# EAGLE design MatrixPi (EAGLE 7.5.0)
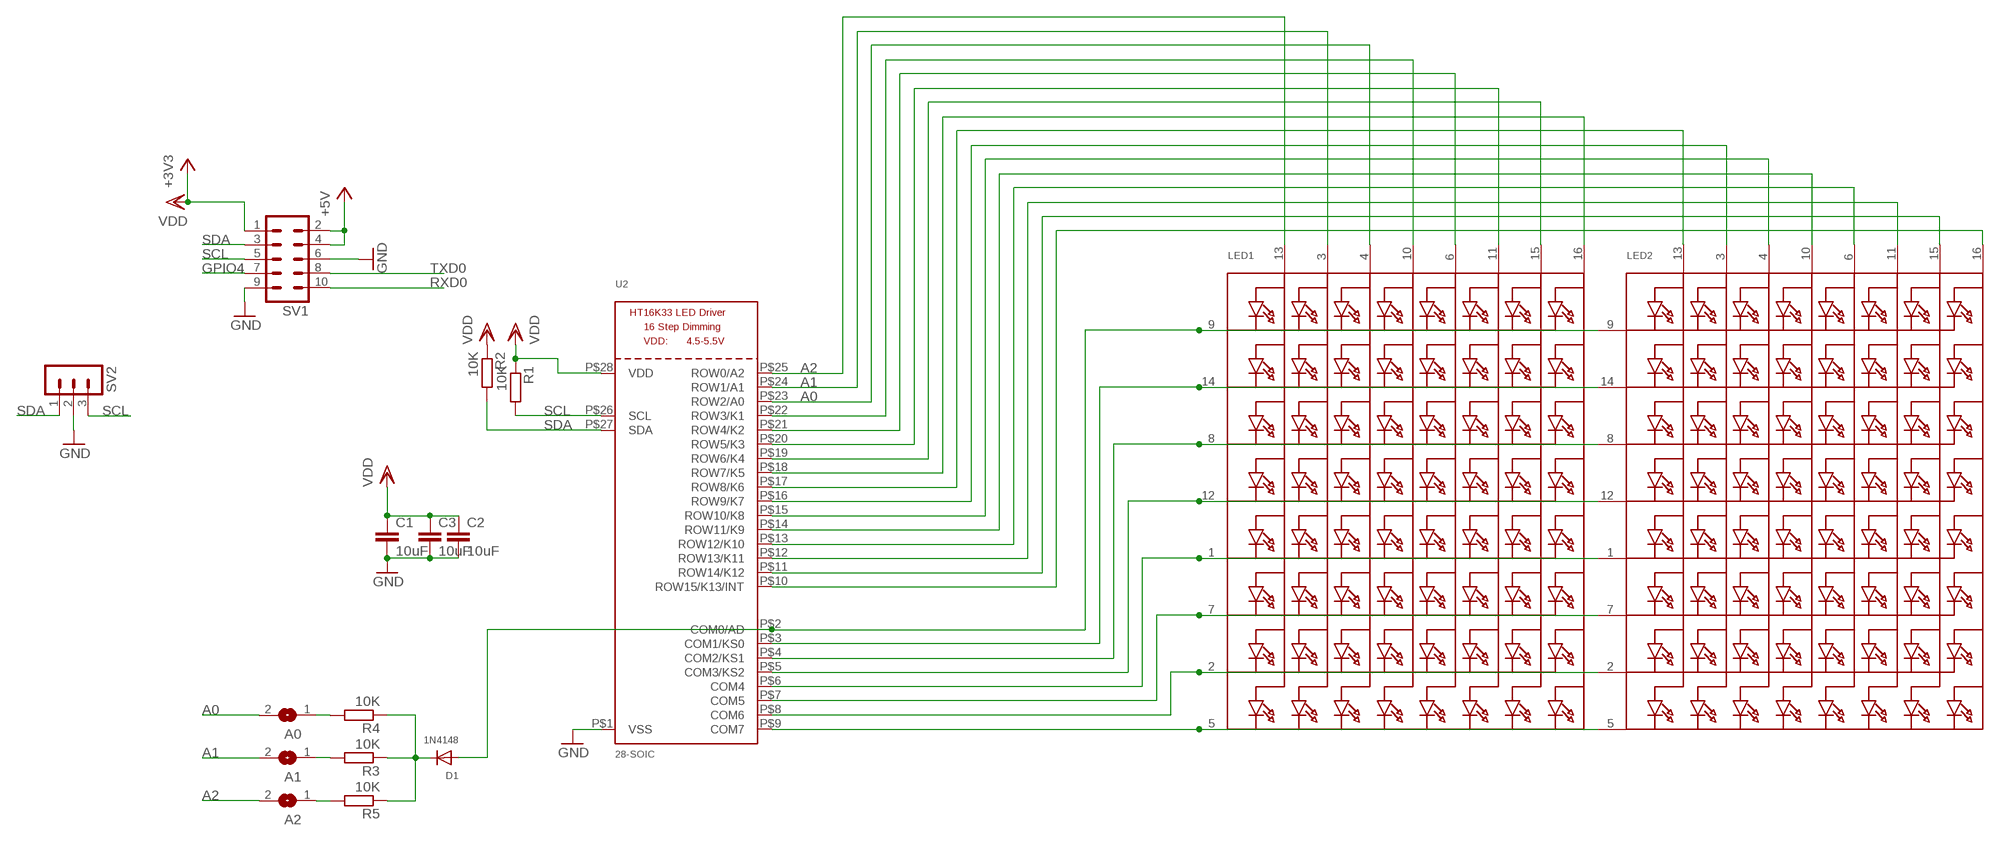
[diagram p0: schematic, sheet 1]

## Parts
A0  SOLDERJUMPERREFLOW_NOPASTE  [SOLDERJUMPER_REFLOW_NOPASTE]
A1  SOLDERJUMPERREFLOW_NOPASTE  [SOLDERJUMPER_REFLOW_NOPASTE]
A2  SOLDERJUMPERREFLOW_NOPASTE  [SOLDERJUMPER_REFLOW_NOPASTE]
C1  10uF  C-EUC0805  [C0805]
C2  10uF  C-EUC0805  [C0805]
C3  10uF  C-EUC0805  [C0805]
D1  1N4148  DIODESOD-323F  [SOD-323F]
LED1  MATRIX_8X8_ROWCATHODE  [TA15-11CGKWA]
LED2  MATRIX_8X8_ROWCATHODE  [TA15-11CGKWA]
R1  10K  R-EU_M0805  [M0805]
R2  10K  R-EU_M0805  [M0805]
R3  10K  R-EU_M0805  [M0805]
R4  10K  R-EU_M0805  [M0805]
R5  10K  R-EU_M0805  [M0805]
SV1  MA05-2  [MA05-2]
SV2  MA03-1  [MA03-1]
U2  28-SOIC  HT16K33_SOP28  [SOP28_300MIL]

## Nets
+5V: SV1.2 SV1.4
A0: A0.2 LED1.4(A3) U2.P$23(ROW2/A0)
A1: A1.2 LED1.3(A2) U2.P$24(ROW1/A1)
A2: A2.2 LED1.13(A1) U2.P$25(ROW0/A2)
GND: C1.2 C2.2 C3.2 SV1.6 SV1.9 SV2.2 U2.P$1(VSS)
GPIO4: SV1.7
N$1: LED1.5(K8) LED2.5(K8) U2.P$9(COM7)
N$2: LED1.2(K7) LED2.2(K7) U2.P$8(COM6)
N$3: LED1.7(K6) LED2.7(K6) U2.P$7(COM5)
N$4: LED1.1(K5) LED2.1(K5) U2.P$6(COM4)
N$5: LED1.12(K4) LED2.12(K4) U2.P$5(COM3/KS2)
N$6: LED1.8(K3) LED2.8(K3) U2.P$4(COM2/KS1)
N$7: LED1.14(K2) LED2.14(K2) U2.P$3(COM1/KS0)
N$8: D1.A LED1.9(K1) LED2.9(K1) U2.P$2(COM0/AD)
N$9: A2.1 R5.2
N$10: LED2.15(A7) U2.P$11(ROW14/K12)
N$11: LED2.11(A6) U2.P$12(ROW13/K11)
N$12: LED2.16(A8) U2.P$10(ROW15/K13/INT)
N$16: D1.C R3.1 R4.1 R5.1
N$19: A1.1 R3.2
N$20: A0.1 R4.2
N$22: LED1.16(A8) U2.P$18(ROW7/K5)
N$23: LED1.15(A7) U2.P$19(ROW6/K4)
N$25: LED1.6(A5) U2.P$21(ROW4/K2)
N$26: LED1.10(A4) U2.P$22(ROW3/K1)
N$35: LED1.11(A6) U2.P$20(ROW5/K3)
N$38: LED2.13(A1) U2.P$17(ROW8/K6)
N$39: LED2.3(A2) U2.P$16(ROW9/K7)
N$40: LED2.10(A4) U2.P$14(ROW11/K9)
N$41: LED2.4(A3) U2.P$15(ROW10/K8)
N$42: LED2.6(A5) U2.P$13(ROW12/K10)
RXD0: SV1.10
SCL: R1.2 SV1.5 SV2.3 U2.P$26(SCL)
SDA: R2.2 SV1.3 SV2.1 U2.P$27(SDA)
TXD0: SV1.8
VDD: C1.1 C2.1 C3.1 R1.1 R2.1 SV1.1 U2.P$28(VDD) ; supply symbol labelled +3V3

## Library data of the parts
A0 A1 A2 = microbuilder:SOLDERJUMPER: SMD Solder JUMPER Solder the two pads together to create a connection, or remove the solder to break it. REFLOW - Use this footprint for solder paste and reflow ovens. WAVE - Use this footprint for hand-soldering (larger pads). CLOSED - Has a trace between the two pads to ensure it is closed by default. The trace needs to be cut to disable the jumper, and can be closed again by creating a solder bridge between the two pads.
C1-C3 = rcl:C-EU: CAPACITOR, European symbol
D1 = adafruit:DIODE: Diode SMADIODE - SMA Surface Mount Package 20V 1A Schottky Diode Digikey: 641-1014-6-ND DO-1N4148 - Through Hole Small Current Diode SOD-123 20V 1 A (.5mV Vf) Schottky Diode - Digikey: MBRX120TPMSCT-ND SOD-323 10V 570mA (.38mV Vf, 3ns) Schottky Diode - Digikey: ZLLS410CT-ND SOD-523 30V 30mA Schottky Diode (RB751S-40TE61) - Digikey: RB751S-40TE61CT-ND SOT23-R/W - SOT23 Package (R = Solder Paste/Reflow Ovens, W = Hand-Soldering) BAT54Film 40V 300mA - Digikey: 497-7162-1-ND
LED1 LED2 = matrix_parts:MATRIX_8X8_ROWCATHODE: 8x8 LED Matrix Displays: Row = Cathode 38mm Green 8x8 Matrix, 3.7mm Round LEDs - TA15-11CGKWA
R1-R5 = resistor:R-EU_: RESISTOR, European symbol
SV1 = con-lstb:MA05-2: PIN HEADER; OC_FARNELL: unknown; OC_NEWARK: unknown
SV2 = con-lstb:MA03-1: PIN HEADER; OC_FARNELL: unknown; OC_NEWARK: unknown
U2 = microbuilder:HT16K33_SOP28

## Board
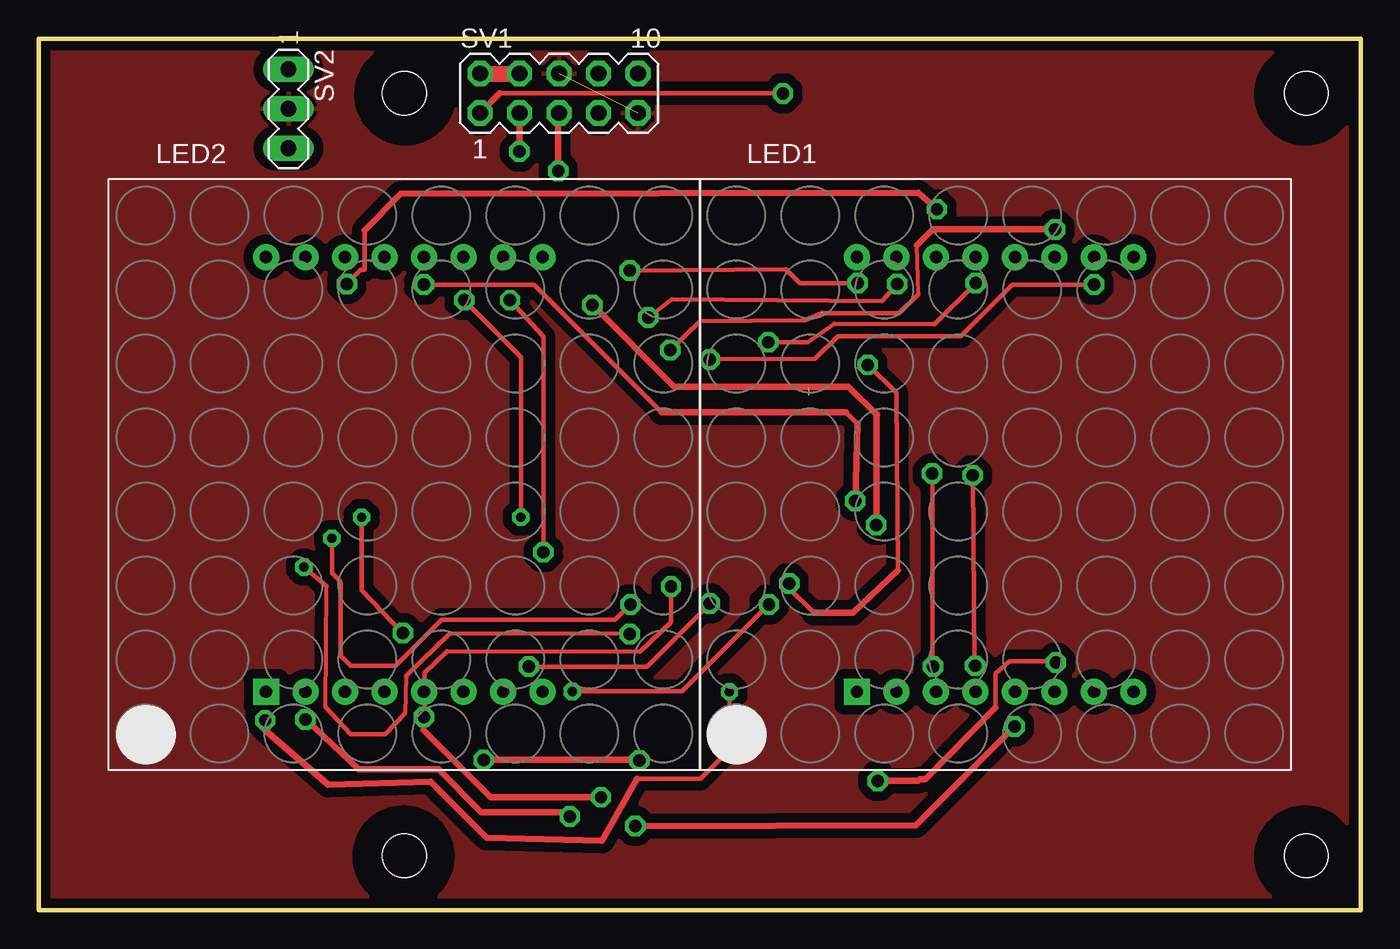
[diagram p1: board, top side]
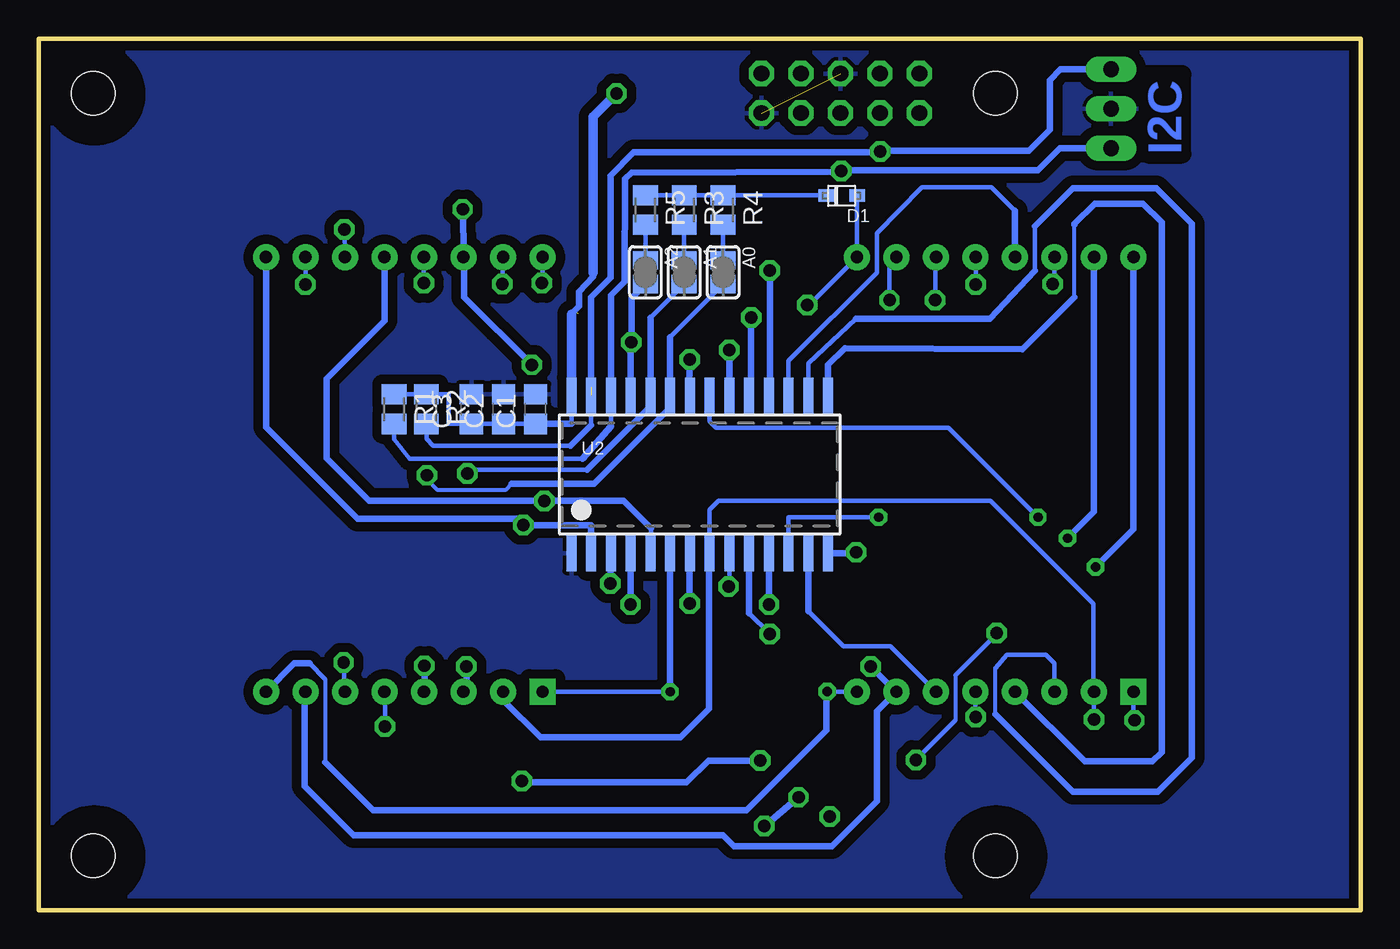
[diagram p2: board, bottom side, seen from below]

Size 85 x 56 mm. Coordinates in mm from the lower left corner, seen from the top.
Outline: 0,0 0,56 85,56 85,0 0,0
Copper layers (1*16): Top 0.035mm / dielectric 1.5mm / Bottom 0.035mm
Design rules "SparkFun": minimum track width 8mil, minimum drill 20mil, track to track 8mil, track to pad 8mil, pad to pad 8mil, via to via 8mil, smd to smd 8mil, copper to edge 10mil, drill to drill 8mil, minimum pad ring 12mil, minimum via ring 10mil, stop-mask expansion 4mil, vias tented up to drill 25mil, thermal gap 10mil
Holes 2.8 mm at 23.5,3.5 81.5,3.5 81.5,52.5 23.5,52.5
tRestrict: area 20.9,0.9 to 26,6; area 78.9,0.9 to 84,6; area 78.9,49.9 to 84,55; area 21,49.9 to 26.1,55
bRestrict: area 20.9,0.9 to 26,6; area 78.9,0.9 to 84,6; area 78.9,49.9 to 84,55; area 21,49.9 to 26.1,55
vRestrict: area 33.2,21.7 to 51.4,34.4; area 52,28.6 to 63.2,34.4; area 39.8,39.1 to 47.1,47.1; area 14.3,47.7 to 20.9,55.7

### Footprints (pad centres in the part's own frame; a part is rotated, then mirrored left to right if it is on the bottom)
SOLDERJUMPER_REFLOW_NOPASTE = smd 1.168 x 1.6: 1 -0.762,0; 2 0.762,0
C0805 = smd 1.3 x 1.5: 1 -0.95,0; 2 0.95,0
SOD-323F = smd 1 x 0.8: A -1,0; C 1,0
TA15-11CGKWA = drill 0.8 pad 1.676 square: 1 -8.89,-13.97 | drill 0.8 pad 1.676: 2 -6.35,-13.97; 3 -3.81,-13.97; 4 -1.27,-13.97; 5 1.27,-13.97; 6 3.81,-13.97; 7 6.35,-13.97; 8 8.89,-13.97; 9 8.89,13.97; 10 6.35,13.97; 11 3.81,13.97; 12 1.27,13.97; 13 -1.27,13.97; 14 -3.81,13.97; 15 -6.35,13.97; 16 -8.89,13.97
M0805 = smd 1.3 x 1.6: 1 -0.95,0; 2 0.95,0
MA05-2 = drill 1.016 octagon: 1 -5.08,-1.27; 2 -5.08,1.27; 3 -2.54,-1.27; 4 -2.54,1.27; 5 0,-1.27; 6 0,1.27; 7 2.54,-1.27; 8 2.54,1.27; 9 5.08,-1.27; 10 5.08,1.27
MA03-1 = drill 1.016 long: 1 -2.54,0; 2 0,0; 3 2.54,0
SOP28_300MIL = smd 0.635 x 2.286: P$1 -8.255,-5.08; P$2 -6.985,-5.08; P$3 -5.715,-5.08; P$4 -4.445,-5.08; P$5 -3.175,-5.08; P$6 -1.905,-5.08; P$7 -0.635,-5.08; P$8 0.635,-5.08; P$9 1.905,-5.08; P$10 3.175,-5.08; P$11 4.445,-5.08; P$12 5.715,-5.08; P$13 6.985,-5.08; P$14 8.255,-5.08; P$15 8.255,5.08; P$16 6.985,5.08; P$17 5.715,5.08; P$18 4.445,5.08; P$19 3.175,5.08; P$20 1.905,5.08; P$21 0.635,5.08; P$22 -0.635,5.08; P$23 -1.905,5.08; P$24 -3.175,5.08; P$25 -4.445,5.08; P$26 -5.715,5.08; P$27 -6.985,5.08; P$28 -8.255,5.08

### Placement (x,y rotation side)
A0  41,41 270 bottom
A1  43.5,41 270 bottom
A2  46,41 270 bottom
C1  53.06,32.2 90 bottom
C2  55.12,32.2 90 bottom
C3  57.19,32.2 90 bottom
D1  33.38,45.92 180 bottom
LED1  61.5,28 0 top
LED2  23.5,28 0 top
R1  62.15,32.2 270 bottom
R2  60.08,32.2 270 bottom
R3  43.5,45 270 bottom
R4  41,45 270 bottom
R5  46,45 270 bottom
SV1  33.45,52.5 0 top
SV2  16.05,51.5 270 top
U2  42.5,28 0 bottom

### Tracks (layer width: path | path; a pad name or v marks a point on that pad's centre or on a via)
+5V
  Top 1.016: SV1.2 SV1.4
A0  (via drill 0.8)
  Top 0.305: v60.05,27.95 60.15,15.75 v60.2,15.7
  Bottom 0.254: 54.6,27.4 55,27 59.35,27 60.05,27.7 v60.05,27.95
  Bottom 0.305: A0.2 44.41,36.83 | U2.P$23 44.41,32.3 | 60.2,14.06 LED1.4
  Bottom 0.406: 44.41,36.83 U2.P$23 | 44.41,32.3 49.3,27.4 54.6,27.4 | v60.2,15.7 60.2,14.06
A1  (via drill 0.8)
  Top 0.305: v57.45,28.05 57.45,15.7 v57.5,15.65
  Bottom 0.305: A1.2 45.67,38.06 | U2.P$24 45.67,32.38 | 49.75,28.3 57.2,28.3 v57.45,28.05 | 57.5,14.22 LED1.3
  Bottom 0.406: 45.67,38.06 U2.P$24 | 45.67,32.38 49.75,28.3 | v57.5,15.65 57.5,14.22
A2  (via drill 0.8)
  Top 0.305: v60.25,40.3 57.6,37.65 51.15,37.7 49.45,36.5 v46.9,36.5
  Bottom 0.305: LED1.13 v60.25,40.3
  Bottom 0.406: A2.2 46.9,39.34 v46.9,36.5 46.95,36.45 U2.P$25
GND  (1 unrouted)
  pour Top (isolate 0.61): 0,55.88 0,0 86.36,0 86.36,55.88
  pour Bottom (isolate 0.61): 0,55.88 0,0 86.36,0 86.36,55.88
N$1  (via drill 0.8)
  Top 0.305: 24.75,11.55 v24.75,12.4 24.8,12.45 24.8,15.25 26.25,16.65 38.65,16.6 40.65,18.5 v40.65,20.8
  Top 0.406: 24.75,11.55 29.05,7.25 v36.15,7.25 | v38.35,5.4 56.4,5.45 v62.75,11.8
  Bottom 0.305: LED2.5 24.77,12.42 v24.75,12.4 | v62.75,11.8 62.75,14.01 LED1.5 | U2.P$9 40.59,20.86 v40.65,20.8
  Bottom 0.406: v36.15,7.25 v38.35,5.4
N$2  (via drill 0.8)
  Top 0.305: 33.9,6 v34.15,6 33.85,6.3
  Top 0.406: v17.15,12.25 20.55,9.05 25.7,9.05 28.45,6.3 33.85,6.3
  Bottom 0.305: v17.15,12.25 LED2.2 17.2,14.08 17.2,19.7 23.8,26.3 41.3,26.3 41.87,25.73 U2.P$8
  Bottom 0.406: LED1.2 55.15,13.5 52.75,11.1 43.75,11.1 41.9,12.95 41.9,22.89 U2.P$8
N$3  (via drill 0.8)
  Top 0.305: v43.15,19.7 39.1,15.65 v31.5,15.65
  Bottom 0.305: 67.9,13.98 LED1.7 | U2.P$7 43.15,22.91 | 29.88,14.03 LED2.7
  Bottom 0.406: 43.15,22.91 v43.15,19.7 | v31.5,15.65 29.88,14.03 | 67.9,13.98 67.9,7.95 64.75,4.8 41,4.8 40.3,4.1 34,4.1 31.1,7 31.1,12.78 LED2.7
N$4  (via drill 0.6, 0.8)
  Top 0.305: 14.55,11.55 v14.55,12.2 | 38.45,8.45 42.55,8.45 44.4,10.3 v44.4,14.03 v44.41,14.03
  Top 0.406: 14.55,11.55 18.6,8.05 25.2,8.25 28.8,4.65 36.2,4.45 38.45,8.45
  Bottom 0.305: v44.41,14.03 LED1.1 | v14.55,12.2 14.61,12.26 LED2.1
  Bottom 0.406: U2.P$6 v44.41,14.03
N$5  (via drill 0.8)
  Top 0.305: v24.75,40.2 31.85,40.2 40.05,32 | 51.9,32 52.65,31.25
  Top 0.406: 40.05,32 51.9,32 | 52.65,31.25 v52.5,26.3
  Bottom 0.305: LED2.12 24.75,41.97 v24.75,40.2 | 45.65,24.55 45.65,22.95 U2.P$5
  Bottom 0.406: LED1.12 62.77,37.88 66.5,34.15 66.5,29.05 63.75,26.3 v52.5,26.3 47.4,26.3 45.65,24.55
N$6  (via drill 0.6, 0.8)
  Top 0.305: v46.95,19.65 41.35,14.05 v34.3,14.05
  Bottom 0.254: 66.6,14.85 66.6,9.5
  Bottom 0.305: 67.6,15.85 66.6,14.85 | 32.35,13.99 LED2.8 34.28,14.03 v34.3,14.05 | v46.95,19.66 v46.95,19.65
  Bottom 0.406: LED1.8 68.57,15.85 67.6,15.85 | U2.P$4 v46.95,19.66 | 66.6,9.5 63.5,6.4 39.5,6.4 34.35,11.55 34.35,14 v34.3,14.05
N$7  (via drill 0.8)
  Top 0.305: v53.3,35.05 55.15,33.25 55.25,21.85 | 49.85,19.1 48.25,20.7 v48.25,21 | 19.75,40.15 v19.8,40.25 20.7,41.15 20.95,41.15 20.95,43.7
  Top 0.406: 55.25,21.85 52.35,19.1 49.85,19.1 | 20.95,43.7 23.25,46.05 56.55,46.1 v57.75,45.05
  Bottom 0.305: U2.P$3 48.25,22.89 | 57.65,41.93 LED1.14 57.65,42.01 | LED2.14 19.69,40.36 v19.8,40.25
  Bottom 0.406: 48.25,22.89 v48.25,21 | 57.65,41.93 57.65,39.4 v53.3,35.05 | v57.75,45.05 57.65,42.01
N$8  (via drill 0.8)
  Top 0.305: 53.9,31.85 53.85,31.9
  Top 0.406: v35.6,38.9 40.85,33.65 52.05,33.65 53.9,31.85 | 53.85,31.9 v53.85,24.75
  Bottom 0.305: D1.A 32.38,41.98 LED2.9 35.46,38.9 v35.6,38.9 | 49.5,22.93 U2.P$2 | v53.85,24.75 53.75,25.15
  Bottom 0.406: LED1.9 70.39,31.04 64.5,25.15 53.75,25.15 | v53.85,24.75 49.48,24.75 U2.P$2
N$9
  Bottom 0.305: A2.1 R5.2
N$10  (via drill 0.6, 0.8)
  Top 0.305: v38.05,19.65 37.05,18.65 25.9,18.65 22.95,15.7 20.05,15.7 19.4,16.35 19.4,21.1 18.85,21.65 v18.85,23.9
  Bottom 0.305: U2.P$11
  Bottom 0.406: U2.P$11 v38.05,19.65 | v18.85,23.9 17.15,25.6 LED2.15
N$11  (via drill 0.6, 0.8)
  Top 0.305: v31,25.25 31,35.55 v27.35,39.2
  Bottom 0.305: U2.P$12 36.78,25.25 v31,25.25 | v27.35,39.2 27.35,41.93 LED2.11
N$12  (via drill 0.6, 0.8)
  Top 0.254: 23.6,15.05 23.55,12.65 | 18.45,13.05 18.5,20.8
  Top 0.305: v38,17.75 26.45,17.8 23.6,15.05 | 23.55,12.65 22.25,11.3 20.05,11.3 18.45,13.05 | 18.5,20.8 v17.05,22.05
  Bottom 0.305: 39.33,19.07 v38,17.75
  Bottom 0.406: U2.P$10 39.33,19.07 | v17.05,22.05 14.61,24.49 LED2.16
N$16
  Bottom 0.305: R5.1 R3.1 R4.1 34.41,45.95 D1.C 34.3,45.95
N$19
  Bottom 0.305: A1.1 R3.2
N$20
  Bottom 0.305: A0.1 R4.2
N$22  (via drill 0.8)
  Top 0.305: v38,41.1 48.05,41.2 48.95,40.3 v52.65,40.3
  Bottom 0.305: U2.P$18 38,33 | v52.65,40.3 52.61,40.34 LED1.16
  Bottom 0.406: 38,33 v38,41.1
N$23  (via drill 0.8)
  Top 0.305: v55.2,40.25 54.2,39.15 40.7,39.25 v39.2,38.1
  Bottom 0.305: U2.P$19 39.2,33.16 | v55.2,40.25 LED1.15
  Bottom 0.406: 39.2,33.16 v39.2,38.1
N$25  (via drill 0.6, 0.8)
  Top 0.305: v20.75,25.25 20.75,20.55 v23.4,17.8 | 38.55,9.65 v38.6,9.6 | 61.5,13 61.5,15.2 62.4,16 64.65,16 v65.4,15.9
  Top 0.406: v28.6,9.65 38.55,9.65 | v53.95,8.3 56.55,8.3 56.65,8.4 57,8.4 61.5,13
  Bottom 0.254: 26.05,15.1 26.05,12.2
  Bottom 0.305: U2.P$21 41.87,31.41 41.45,31 26.5,31 v20.75,25.25 | v23.4,17.8 23.65,17.5 26.05,15.1 | 26.05,12.2 v28.6,9.65 | 53.85,8.2 v53.95,8.3 | v65.4,15.9 65.35,14.07 LED1.6
  Bottom 0.406: v38.6,9.6 41.95,9.6 43.35,8.2 53.85,8.2
N$26  (via drill 0.8)
  Top 0.305: v43.15,35.4 49.9,35.45 51.4,36.9 59.3,36.9 62.6,40.2 v67.85,40.2
  Bottom 0.305: U2.P$22 43.2,33.15 | v67.85,40.2 LED1.10
  Bottom 0.406: 43.2,33.15 v43.15,35.4
N$35  (via drill 0.8)  (1 unrouted)
  Top 0.254: 56.55,39.6 56.45,42.75
  Top 0.305: 50.4,38.4 49.25,37.9 42.5,37.85 v40.6,36 | 56.55,39.6 55.32,38.37 50.33,38.37
  Top 0.406: 56.45,42.75 57.5,43.75 v65.35,43.75
  Bottom 0.305: v65.35,43.75 LED1.11
  Bottom 0.406: U2.P$20 v40.6,36
N$38
  Bottom 0.305: U2.P$17 36.78,35.31 31.1,40.95 31.1,43.5 28.2,46.45 23.75,46.45 22.25,44.95 | 22.25,41.99 LED2.13
  Bottom 0.406: 22.25,44.95 22.25,41.99
N$39
  Bottom 0.254: 23.5,12.6 23.5,15.55
  Bottom 0.305: U2.P$16 35.52,35.13 32.45,38 | 20.95,41.1 20.95,43.95 | 23.5,15.55 22.75,16.4 20.25,16.4 19.7,15.85 LED2.3
  Bottom 0.406: 32.45,38 23.85,38 20.95,41.1 | 20.95,43.95 18.5,46.4 13.15,46.4 10.85,44.1 10.85,9.8 13.05,7.6 18.5,7.6 23.5,12.6
N$40  (via drill 0.8)
  Top 0.305: v30.3,39.2 32.45,36.85 v32.45,23
  Bottom 0.305: LED2.10 30.3,41.52 v30.3,39.2 | v32.45,23 32.53,22.92
  Bottom 0.406: 32.53,22.92 U2.P$14
N$41
  Bottom 0.254: 18.4,39.4 18.4,44.05
  Bottom 0.305: 22.25,14.01 LED2.4
  Bottom 0.406: U2.P$15 34.24,35.05 33.15,36.1 21.75,36.05 18.4,39.4 | 18.4,44.05 18.4,44.1 17.1,45.4 14,45.4 12.8,44.2 12.8,10.15 13.4,9.55 17.75,9.55 LED2.4
N$42
  Bottom 0.305: 35.52,19.21 33.25,16.95 30.23,16.95 LED2.6
  Bottom 0.406: U2.P$13 35.52,19.21
SCL  (via drill 0.8)
  Top 0.305: 33.4,51.23 SV1.5
  Top 0.406: v33.4,47.5 33.4,51.23
  Bottom 0.305: U2.P$26 48.22,31.09 | 50.05,29 61.15,29 62.15,30.25 R1.2 | 33.45,47.45 v33.4,47.5 33.35,47.55
  Bottom 0.406: 48.22,31.09 50.05,29 | SV2.3 19.34,48.96 20.75,47.55 33.35,47.55 | 33.45,47.45 46.9,47.4 47.3,47 47.35,40.4 48.22,39.53 U2.P$26
SDA  (via drill 0.8)  (1 unrouted)
  Top 0.305: 30.9,51.22 SV1.3
  Top 0.406: v30.9,48.75 30.9,51.22
  Bottom 0.305: R2.2 60.08,30.28 59.65,29.85 50.8,29.85 | 49.5,31.15 49.5,33.06 U2.P$27 | 30.85,48.8 v30.9,48.75
  Bottom 0.406: 50.8,29.85 49.5,31.15 | SV2.1 19.31,54.04 20,53.35 20,50.15 21.35,48.8 30.85,48.8 | v30.9,48.75 30.95,48.7 46.75,48.7 48.25,47.2 48.25,40.65 49.5,39.4 49.5,33.6
VDD  (via drill 0.8)
  Top 0.305: 29.64,52.5 v47.85,52.5
  Top 0.406: SV1.1 29.64,52.5
  Bottom 0.254: 49.35,40.95 49.4,40.9
  Bottom 0.305: R1.1 R2.1 58.65,33.15 58.65,31.25 C3.1 C2.1 C1.1 | 50.76,31.25 U2.P$28
  Bottom 0.406: C1.1 50.76,31.25 | 50.76,38.3 50.76,38.34 50.25,38.8 50.25,39.75 49.35,40.7 49.35,40.85 49.4,40.9
  Bottom 0.61: v47.85,52.5 49.35,51 49.35,40.95 | 50.76,38.3 U2.P$28

### Text on the board
Bottom: I2C